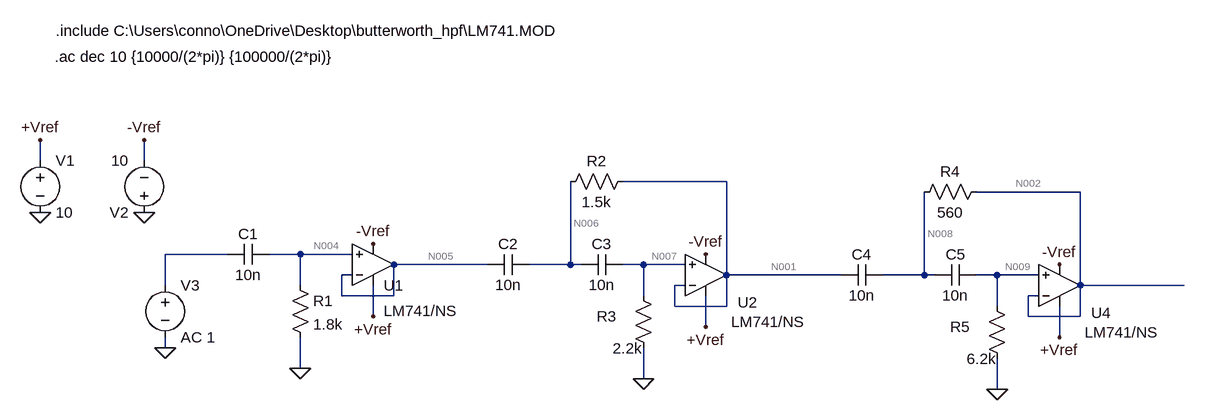
[diagram p0: schematic Draft1.asc]
Draft1.asc, the LTspice schematic file:
Version 4
SHEET 1 1460 820
WIRE -448 -80 -448 -112
WIRE -288 -80 -288 -112
WIRE 608 -48 448 -48
WIRE 1152 -32 992 -32
WIRE -160 64 -256 64
WIRE -48 64 -96 64
WIRE 32 64 -48 64
WIRE 240 80 96 80
WIRE 368 80 368 -48
WIRE 368 80 304 80
WIRE 384 80 368 80
WIRE 480 80 448 80
WIRE 544 80 480 80
WIRE 32 96 16 96
WIRE 608 96 608 -48
WIRE 784 96 608 96
WIRE 912 96 912 -32
WIRE 912 96 848 96
WIRE 928 96 912 96
WIRE 1024 96 992 96
WIRE 1088 96 1024 96
WIRE -256 112 -256 64
WIRE -48 112 -48 64
WIRE 544 112 528 112
WIRE 1152 112 1152 -32
WIRE 1312 112 1152 112
WIRE 16 128 16 96
WIRE 96 128 96 80
WIRE 96 128 16 128
WIRE 480 128 480 80
WIRE 1088 128 1072 128
WIRE 528 144 528 112
WIRE 608 144 608 96
WIRE 608 144 528 144
WIRE 1024 144 1024 96
WIRE 64 160 64 112
WIRE 1072 160 1072 128
WIRE 1152 160 1152 112
WIRE 1152 160 1072 160
WIRE 576 176 576 128
WIRE 1120 192 1120 144
WIRE -256 208 -256 192
WIRE -48 240 -48 192
WIRE 480 256 480 208
WIRE 1024 272 1024 224
FLAG -256 208 0
FLAG -48 240 0
FLAG -448 0 0
FLAG -448 -112 +Vref
FLAG -288 0 0
FLAG -288 -112 -Vref
FLAG 64 48 -Vref
FLAG 64 160 +Vref
FLAG 576 64 -Vref
FLAG 576 176 +Vref
FLAG 480 256 0
FLAG 1120 80 -Vref
FLAG 1120 192 +Vref
FLAG 1024 272 0
SYMBOL voltage -256 96 R0
SYMATTR InstName V3
SYMATTR Value AC 1
SYMBOL cap -96 48 R90
WINDOW 0 0 32 VBottom 2
WINDOW 3 32 32 VTop 2
SYMATTR InstName C1
SYMATTR Value 10n
SYMBOL res -64 96 R0
SYMATTR InstName R1
SYMATTR Value 1.8k
SYMBOL Opamps\\opamp2 64 144 M180
WINDOW 3 16 -7 Left 2
SYMATTR InstName U1
SYMATTR Value LM741/NS
SYMBOL voltage -448 -96 R0
WINDOW 123 0 0 Left 0
WINDOW 39 0 0 Left 0
SYMATTR InstName V1
SYMATTR Value 10
SYMBOL voltage -288 16 R180
WINDOW 123 0 0 Left 0
WINDOW 39 0 0 Left 0
SYMATTR InstName V2
SYMATTR Value 10
SYMBOL Opamps\\opamp2 576 160 M180
WINDOW 0 49 22 Left 2
WINDOW 3 39 -8 Left 2
SYMATTR InstName U2
SYMATTR Value LM741/NS
SYMBOL cap 304 64 R90
WINDOW 0 0 32 VBottom 2
WINDOW 3 32 32 VTop 2
SYMATTR InstName C2
SYMATTR Value 10n
SYMBOL cap 448 64 R90
WINDOW 0 0 32 VBottom 2
WINDOW 3 32 32 VTop 2
SYMATTR InstName C3
SYMATTR Value 10n
SYMBOL res 464 -64 R90
WINDOW 0 0 56 VBottom 2
WINDOW 3 32 56 VTop 2
SYMATTR InstName R2
SYMATTR Value 1.5k
SYMBOL res 464 112 R0
WINDOW 0 -56 48 Left 2
WINDOW 3 -31 97 Left 2
SYMATTR InstName R3
SYMATTR Value 2.2k
SYMBOL Opamps\\opamp2 1120 176 M180
WINDOW 0 49 22 Left 2
WINDOW 3 39 -8 Left 2
SYMATTR InstName U4
SYMATTR Value LM741/NS
SYMBOL cap 848 80 R90
WINDOW 0 0 32 VBottom 2
WINDOW 3 32 32 VTop 2
SYMATTR InstName C4
SYMATTR Value 10n
SYMBOL cap 992 80 R90
WINDOW 0 0 32 VBottom 2
WINDOW 3 32 32 VTop 2
SYMATTR InstName C5
SYMATTR Value 10n
SYMBOL res 1008 -48 R90
WINDOW 0 0 56 VBottom 2
WINDOW 3 32 56 VTop 2
SYMATTR InstName R4
SYMATTR Value 560
SYMBOL res 1008 128 R0
WINDOW 0 -56 48 Left 2
WINDOW 3 -31 97 Left 2
SYMATTR InstName R5
SYMATTR Value 6.2k
TEXT -424 -280 Left 2 !.include C:\\Users\\conno\\OneDrive\\Desktop\\butterworth_hpf\\LM741.MOD
TEXT -426 -240 Left 2 !.ac dec 10 {10000/(2*pi)} {100000/(2*pi)}

The netlist it stands for:
* Draft1.asc
V3 N003 0 AC 1
C1 N004 N003 10n
R1 N004 0 1.8k
XU1 N004 N005 +Vref -Vref N005 LM741/NS  ; pins In+ In- V+ V- OUT
V1 +Vref 0 10
V2 0 -Vref 10
XU2 N007 N001 +Vref -Vref N001 LM741/NS  ; pins In+ In- V+ V- OUT
C2 N006 N005 10n
C3 N007 N006 10n
R2 N001 N006 1.5k
R3 N007 0 2.2k
XU4 N009 N002 +Vref -Vref N002 LM741/NS  ; pins In+ In- V+ V- OUT
C4 N008 N001 10n
C5 N009 N008 10n
R4 N002 N008 560
R5 N009 0 6.2k
.include C:\Users\conno\OneDrive\Desktop\butterworth_hpf\LM741.MOD
.ac dec 10 {10000/(2*pi)} {100000/(2*pi)}
.backanno
.end

* Results of the author's LTspice run, read from the files saved beside the schematic
* Operating Point, zero values left out:
*   V(n004) = -104.2 µV
*   V(n005) = 895.9 µV
*   V(-vref) = -10 V
*   V(+vref) = 10 V
*   V(n001) = 872.7 µV
*   V(n007) = -127.3 µV
*   V(n006) = 872.7 µV
*   V(n002) = 641.3 µV
*   V(n009) = -358.8 µV
*   V(n008) = 641.3 µV
*   I(R5) = -57.86 nA
*   I(R3) = -57.86 nA
*   I(R1) = -57.86 nA
*   I(V2) = -4.729 mA
*   I(V1) = -4.728 mA
*   Ix(u1:1) = 57.86 nA
*   Ix(u1:2) = 101.9 nA
*   Ix(u1:99) = 1.576 mA
*   Ix(u1:50) = -1.576 mA
*   Ix(u1:28) = -101.9 nA
*   Ix(u2:1) = 57.86 nA
*   Ix(u2:2) = 101.9 nA
*   Ix(u2:99) = 1.576 mA
*   Ix(u2:50) = -1.576 mA
*   Ix(u2:28) = -101.9 nA
*   Ix(u4:1) = 57.86 nA
*   Ix(u4:2) = 101.9 nA
*   Ix(u4:99) = 1.576 mA
*   Ix(u4:50) = -1.576 mA
*   Ix(u4:28) = -101.9 nA
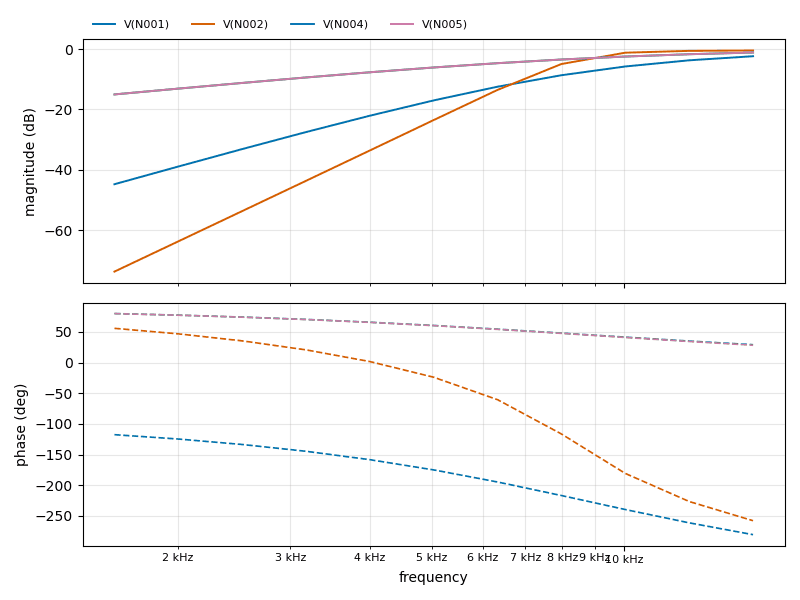
[diagram p1: AC Analysis of Draft1.asc, plotted from the saved traces]
* AC Analysis, 1 run:
*   V(N001): -44.76 dB at 1.592 kHz, -2.39 dB at 15.92 kHz, peak -2.39 dB at 15.92 kHz, 3 dB below the peak at 10.48 kHz
*   V(N002): -73.68 dB at 1.592 kHz, -0.49 dB at 15.92 kHz, peak -0.49 dB at 15.92 kHz, 3 dB below the peak at 8.724 kHz
*   V(N004): -15.03 dB at 1.592 kHz, -1.17 dB at 15.92 kHz, peak -1.17 dB at 15.92 kHz, 3 dB below the peak at 6.987 kHz
*   V(N005): -15.03 dB at 1.592 kHz, -1.16 dB at 15.92 kHz, peak -1.16 dB at 15.92 kHz, 3 dB below the peak at 6.988 kHz